# Altium schematic sheet NRF52840.SchDoc: NRF52840
size A3; Author: A.Horvath; Organization: Reichle & De-Massari; Address1: Binzstrasse 32; Address2: 8620 Wetzikon; Address3: Switzerland; DocumentNumber: 3; Revision: V0.1; SheetNumber: 3; SheetTotal: 11
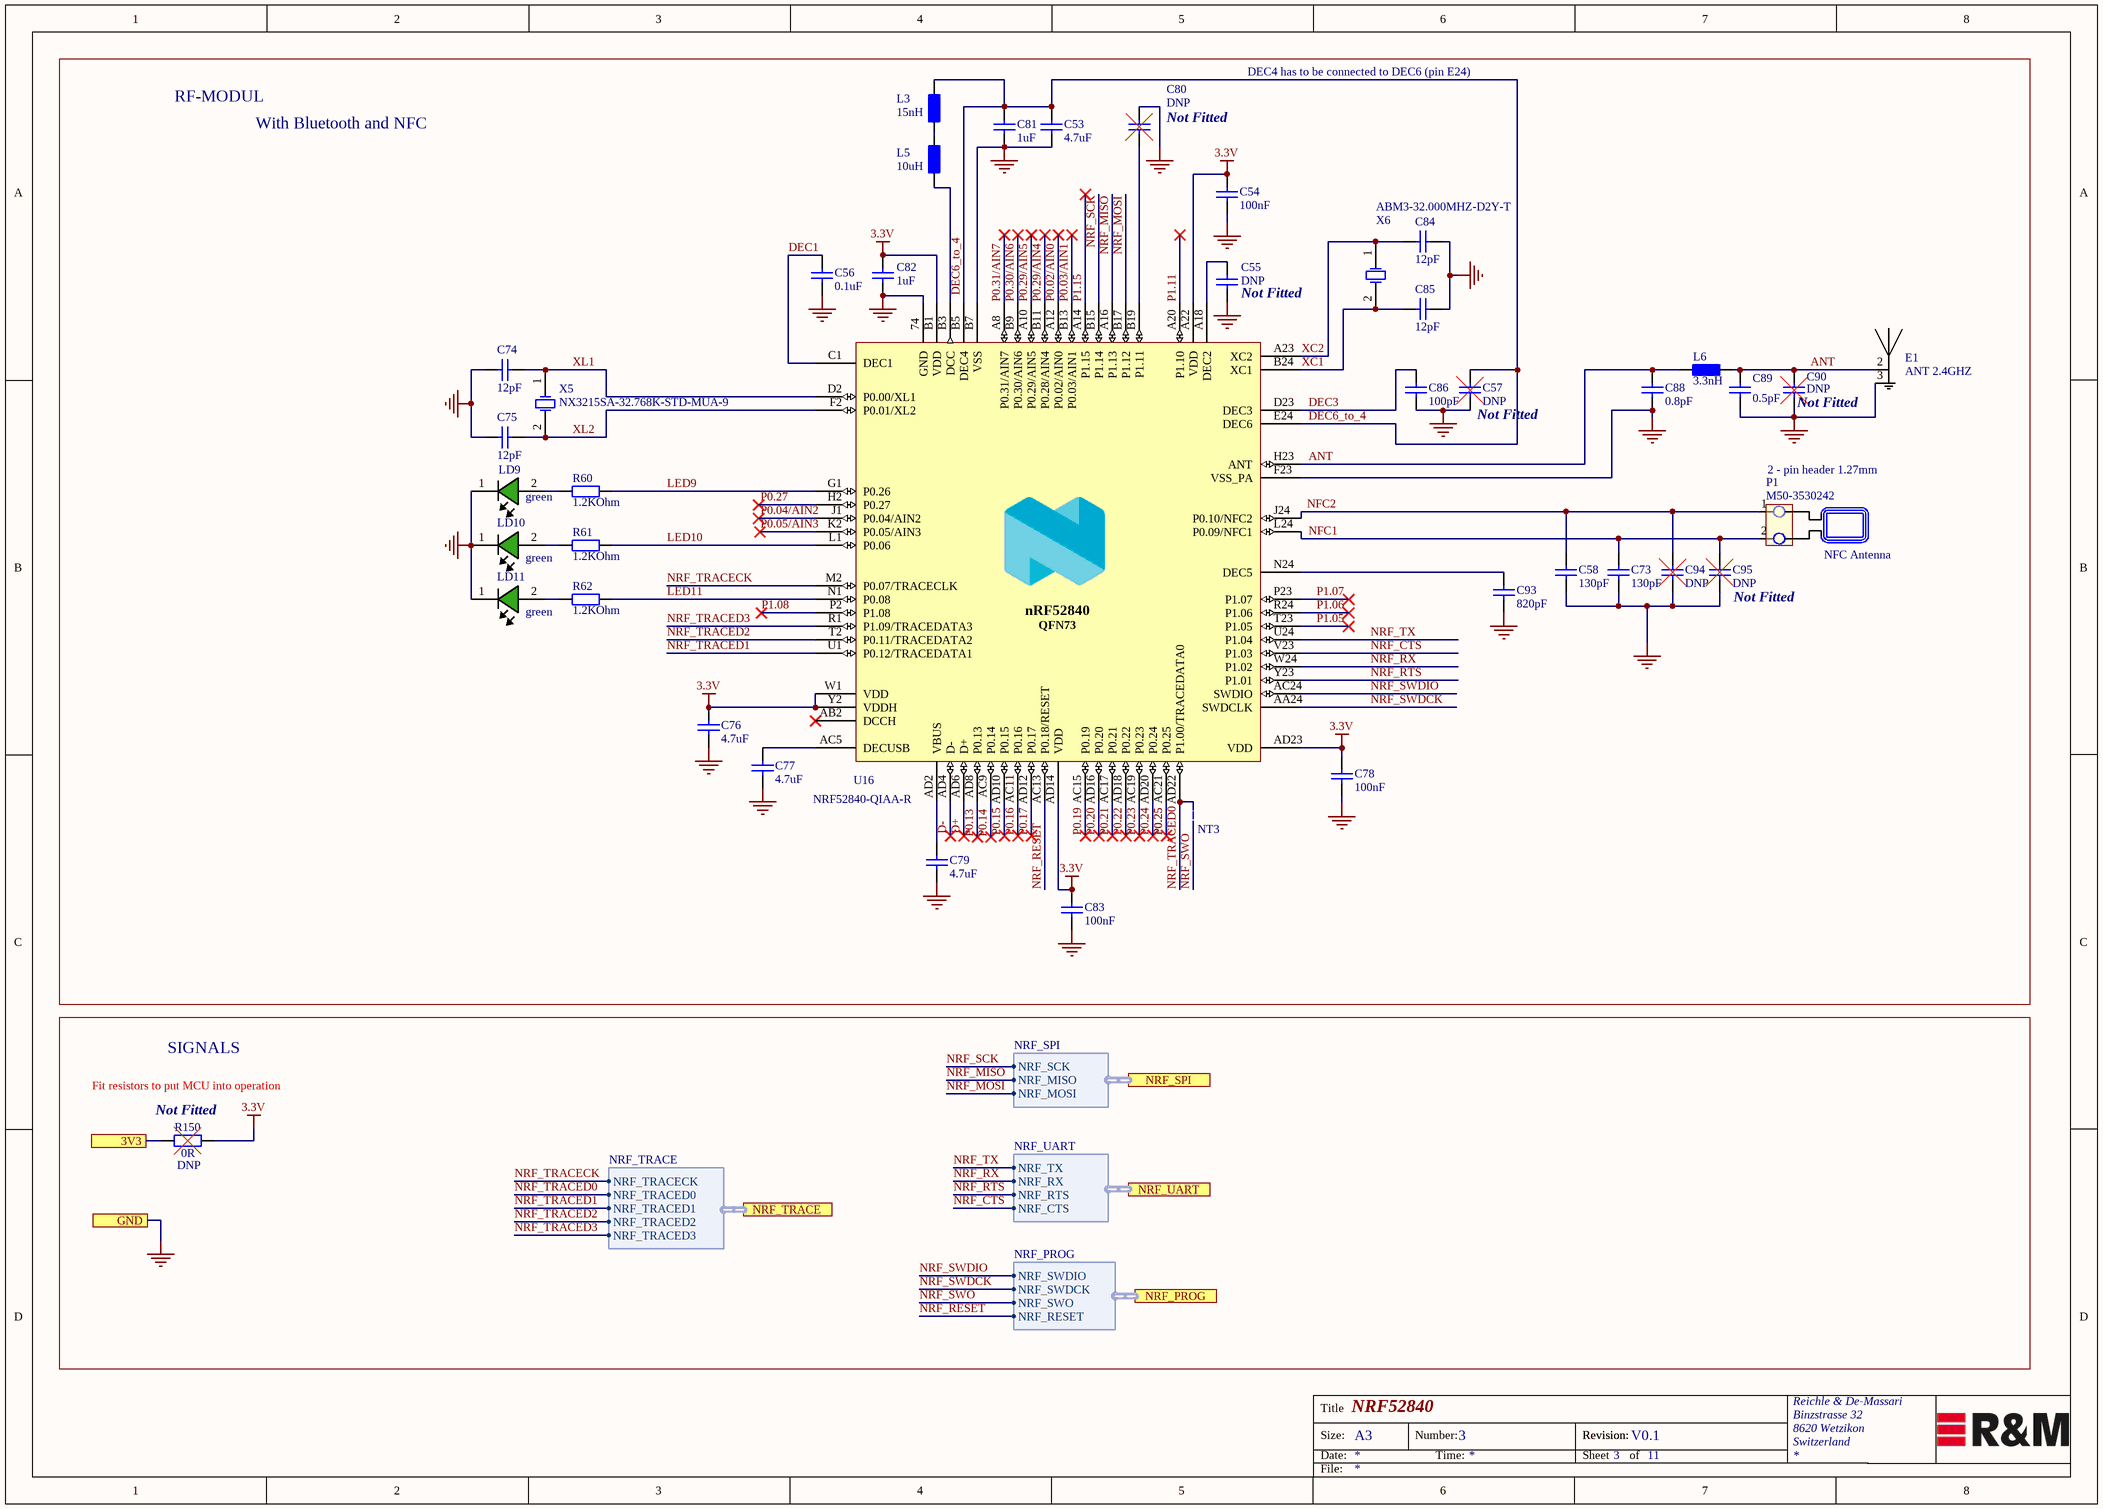
[diagram p0: NRF52840.SchDoc]

## Parts
C53  4.7uF  [Ceramic Capacitor 0402 EIA]
C54  100nF  [Ceramic Capacitor 0402 EIA]
C55  DNP  [Ceramic Capacitor 0402 EIA]
C56  0.1uF  [Ceramic Capacitor 0402 EIA]
C57  DNP  [Ceramic Capacitor 0402 EIA]
C58  130pF  [Ceramic Capacitor 0805 EIA]
C73  130pF  [Ceramic Capacitor 0805 EIA]
C74  12pF  [Ceramic Capacitor 0402 EIA]
C75  12pF  [Ceramic Capacitor 0402 EIA]
C76  4.7uF  [Ceramic Capacitor 0402 EIA]
C77  4.7uF  [Ceramic Capacitor 0402 EIA]
C78  100nF  [Ceramic Capacitor 0402 EIA]
C79  4.7uF  [Ceramic Capacitor 0402 EIA]
C80  DNP  [Ceramic Capacitor 0402 EIA]
C81  1uF  [Ceramic Capacitor 0402 EIA]
C82  1uF  [Ceramic Capacitor 0402 EIA]
C83  100nF  [Ceramic Capacitor 0402 EIA]
C84  12pF  [Ceramic Capacitor 0402 EIA]
C85  12pF  [Ceramic Capacitor 0402 EIA]
C86  100pF  [Ceramic Capacitor 0402 EIA]
C88  0.8pF  [Ceramic Capacitor 0402 EIA]
C89  0.5pF  [Ceramic Capacitor 0402 EIA]
C90  DNP  [Ceramic Capacitor 0805 EIA]
C93  820pF  [Ceramic Capacitor 0402 EIA]
C94  DNP  [Ceramic Capacitor 0805 EIA]
C95  DNP  [Ceramic Capacitor 0805 EIA]
E1  ANT 2.4GHZ  [XCVR_A5839]
L3  15nH  [INDC1005X55N]
L5  10uH  [INDC1608X100N]
L6  3.3nH  [LQG15HS3N3S02D]
LD9  green  [LED_APHHS1005CGCK]
LD10  green  [LED_APHHS1005CGCK]
LD11  green  [LED_APHHS1005CGCK]
NT3  Net-Tie_Small  [NET_TIE]  (value not drawn)  (net tie, no BOM)
P1  M50-3530242  [CONN_2x01_Harwin]  (net tie)
R60  1.2KOhm  [Resistor 0402 EIA]
R61  1.2KOhm  [Resistor 0402 EIA]
R62  1.2KOhm  [Resistor 0402 EIA]
R150  DNP  [Resistor 0805 EIA]
U16  NRF52840-QIAA-R  [AQFN50P700X700X85_HS-74N]
X5  NX3215SA-32.768K-STD-MUA-9  [NX3215SA]
X6  ABM3-32.000MHZ-D2Y-T  [XTAL500X320X130N]

## Blocks framed on the sheet
SIGNALS: R150

## Ports
3V3, GND, NRF_PROG (harness NRF_PROG), NRF_SPI (harness NRF_SPI), NRF_TRACE (harness NRF_TRACE), NRF_UART (harness NRF_UART)

## Harnesses
NRF_TRACE: NRF_TRACECK, NRF_TRACED0, NRF_TRACED1, NRF_TRACED2, NRF_TRACED3
NRF_UART: NRF_TX, NRF_RX, NRF_RTS, NRF_CTS
NRF_SPI: NRF_SCK, NRF_MISO, NRF_MOSI
NRF_PROG: NRF_SWDIO, NRF_SWDCK, NRF_SWO, NRF_RESET

## Nets
3.3V: C54.2 C76.2 C78.2 C82.2 C83.2 R150.2 U16.A22(VDD) U16.AD14(VDD) U16.AD23(VDD) U16.B1(VDD) U16.W1(VDD) U16.Y2(VDDH)
GND: C53.1 C54.1 C55.1 C56.1 C57.1 C58.1 C73.1 C74.2 C75.2 C76.1 C77.1 C78.1 C79.1 C80.2 C81.1 C82.1 C83.1 C84.1 C85.1 C86.1 C88.2 C89.1 C90.1 C93.1 C94.1 C95.1 E1.3(GND) LD9.1 LD10.1 LD11.1 U16.74(GND) U16.B7(VSS) U16.F23(VSS_PA) ; port GND
3V3: R150.1 ; port 3V3
ANT: C88.1 C89.2 C90.2 E1.2(FED) L6.1 L6.2 U16.H23(ANT)
D+: U16.AD6(D+)
D-: U16.AD4(D-)
DEC1: C56.2 U16.C1(DEC1)
DEC3: C86.2 U16.D23(DEC3)
DEC6_to_4: C53.2 C57.2 C81.2 L3.1 U16.B5(DEC4) U16.E24(DEC6)
LED9: R60.2 U16.G1(P0.26)
LED10: R61.2 U16.L1(P0.06)
LED11: R62.2 U16.N1(P0.08)
NFC1: C73.2 C95.2 P1.2 U16.L24(P0.09/NFC1)
NFC2: C58.2 C94.2 P1.1 U16.J24(P0.10/NFC2)
NRF_CTS: U16.V23(P1.03) ; port NRF_UART.NRF_CTS
NRF_MISO: U16.A16(P1.13) ; port NRF_SPI.NRF_MISO
NRF_MOSI: U16.B17(P1.12) ; port NRF_SPI.NRF_MOSI
NRF_RESET: U16.AC13(P0.18/RESET) ; port NRF_PROG.NRF_RESET
NRF_RTS: U16.Y23(P1.01) ; port NRF_UART.NRF_RTS
NRF_RX: U16.W24(P1.02) ; port NRF_UART.NRF_RX
NRF_SCK: U16.B15(P1.14) ; port NRF_SPI.NRF_SCK
NRF_SWDCK: U16.AA24(SWDCLK) ; port NRF_PROG.NRF_SWDCK
NRF_SWDIO: U16.AC24(SWDIO) ; port NRF_PROG.NRF_SWDIO
NRF_SWO: NT3.1 ; port NRF_PROG.NRF_SWO
NRF_TRACECK: U16.M2(P0.07/TRACECLK) ; port NRF_TRACE.NRF_TRACECK
NRF_TRACED0: NT3.2 U16.AD22(P1.00/TRACEDATA0) ; port NRF_TRACE.NRF_TRACED0
NRF_TRACED1: U16.U1(P0.12/TRACEDATA1) ; port NRF_TRACE.NRF_TRACED1
NRF_TRACED2: U16.T2(P0.11/TRACEDATA2) ; port NRF_TRACE.NRF_TRACED2
NRF_TRACED3: U16.R1(P1.09/TRACEDATA3) ; port NRF_TRACE.NRF_TRACED3
NRF_TX: U16.U24(P1.04) ; port NRF_UART.NRF_TX
P0.02/AIN0: U16.A12(P0.02/AIN0)
P0.03/AIN1: U16.B13(P0.03/AIN1)
P0.04/AIN2: U16.J1(P0.04/AIN2)
P0.05/AIN3: U16.K2(P0.05/AIN3)
P0.13: U16.AD8(P0.13)
P0.14: U16.AC9(P0.14)
P0.15: U16.AD10(P0.15)
P0.16: U16.AC11(P0.16)
P0.17: U16.AD12(P0.17)
P0.19: U16.AC15(P0.19)
P0.20: U16.AD16(P0.20)
P0.21: U16.AC17(P0.21)
P0.22: U16.AD18(P0.22)
P0.23: U16.AC19(P0.23)
P0.24: U16.AD20(P0.24)
P0.25: U16.AC21(P0.25)
P0.27: U16.H2(P0.27)
P0.29/AIN4: U16.B11(P0.28/AIN4)
P0.29/AIN5: U16.A10(P0.29/AIN5)
P0.30/AIN6: U16.B9(P0.30/AIN6)
P0.31/AIN7: U16.A8(P0.31/AIN7)
P1.05: U16.T23(P1.05)
P1.06: U16.R24(P1.06)
P1.07: U16.P23(P1.07)
P1.08: U16.P2(P1.08)
P1.11: U16.A20(P1.10)
P1.15: U16.A14(P1.15)
XC1: C85.2 U16.B24(XC1) X6.2(OSC2)
XC2: C84.2 U16.A23(XC2) X6.1(OSC1)
XL1: C74.1 U16.D2(P0.00/XL1) X5.1(OSC1)
XL2: C75.1 U16.F2(P0.01/XL2) X5.2(OSC2)
NetC55_2: C55.2 U16.A18(DEC2)
NetC77_2: C77.2 U16.AC5(DECUSB)
NetC79_2: C79.2 U16.AD2(VBUS)
NetC80_1: C80.1 U16.B19(P1.11)
NetC93_2: C93.2 U16.N24(DEC5)
NetL3_2: L3.2 L5.1
NetL5_2: L5.2 U16.B3(DCC)
NetLD9_2: LD9.2 R60.1
NetLD10_2: LD10.2 R61.1
NetLD11_2: LD11.2 R62.1

Not connected (* = marked no-connect by the designer): U16 AB2(DCCH)*

## Notes on the sheet
- RF-MODUL
- DEC4 has to be connected to DEC6 (pin E24)
- With Bluetooth and NFC
- (near C80) Not Fitted
- (near C55) Not Fitted
- (near C57) Not Fitted
- (near C90) Not Fitted
- (near P1) 2 - pin header 1.27mm
- (near P1) NFC Antenna
- (near C95) Not Fitted
- (near R150) Fit resistors to put MCU into operation
- (near R150) Not Fitted
- (near R150) 0R
- Title
- Size:
- Date:
- A3
- Number:
- Time:
- Revision:
- Sheet
- of
- File:
- (in symbol nRF52840_QIAA) nRF52840; QFN73

## Library data of the parts
C53 C76 C77 C79 = Cap_4.7uF_0603 _6.3V_X7R: 4.7µF ±10% 6.3V Ceramic Capacitor X7R 0603 (1608 Metric); Manufracturer: Taiyo Yuden; Manufacturer PartNr: JMK107BB7475KA-T; voltage: 6.3VDC; Replaceable: yes; tolerance: ±10%; ComponentLink1Description: mouser; ComponentLink1URL: https://www.mouser.ch/ProductDetail/Murata-Electronics/GRM155R60J475ME47D?qs=sGAEpiMZZMs0AnBnWHyRQIE6q%2f4qwWvwbJmEUwav8%2f4%3d; Dielectric Grade: X7R; Footprint/Package: 0603 (1608 metric); Supplier 1: Digi-Key; Supplier Part Number 1: 587-5870-1-ND; value: 4.7uF
C54 C78 C83 = Cap_100nF_0402_6V3: 0.1µF ±10% 6.3V Ceramic Capacitor X7R 0402 (1005 Metric); Manufacturer: Yageo; Manufacturer PartNr: CC0402KRX7R5BB104; Replaceable: yes; volatage: 6.3VDC; Dielectric Grade: X7R; Footprint/Package: 0402 (1005 metric); Supplier 1: Digi-Key; Supplier Part Number 1: 311-1701-1-ND; value: 100nF; tolerance: ±10%
C55 C57 = Cap_DNP_0402: Do not place 0402  (1005 metric) - placeholder; Replaceable: no; value: DNP; tolerance: *; voltage: *; Dielectric Grade: *; Manufacturer: N/A; Manufacturer PartNr: N/A; Footprint/Package: 0402 (1005 metric); Supplier 1: N/A; Supplier Part Number 1: N/A; Remark: do not place
C56 = Cap_0.1uF_0402_16V_10%: 0.1µF ±10% 16V Ceramic Capacitor X7R 0402 (1005 Metric); Manufacturer: Yageo; Manufacturer PartNr: CC0402KRX7R7BB104; voltage: 16VDC; Replaceable: yes; value: 0.1uF; tolerance: 10%; Footprint/Package: 0402 (1005 Metric); Dielectric Grade: X7R; ComponentLink1Description: mouser; ComponentLink1URL: https://www.mouser.ch/ProductDetail/KEMET/C0402C104M4RACAUTO?qs=sGAEpiMZZMs0AnBnWHyRQB295tntAovf0Dzw3tVX6zRfKTwHFThmZw%3d%3d; Supplier 1: Digi-Key; Supplier Part Number 1: 311-1338-1-ND
C58 C73 = Cap_130pF_0805 _50V: 130pF ±5% 50V Ceramic Capacitor C0G, NP0 0805 (2012 Metric); Manufacturer: KEMET; Manufacturer PartNr: C0805C131J5GAC7800; voltage: 50V DC; Dielectric Grade: C0G/NP0; Replaceable: yes; Supplier 1: Digi-Key; Supplier Part Number 1: 399-15446-1-ND; Footprint/Package: 0805 (2012 metric); value: 130pF; tolerance: ±5%; power: -
C74 C75 C84 C85 = Cap_12pF_0402_50V: 12pF ±2% 50V Ceramic Capacitor C0G, NP0 0402 (1005 Metric); Manufacturer: Murata; Manufacturer PartNr: GRM1555C1H120GA01D; voltage: 50VDC; Replaceable: yes; Dielectric Grade: C0G/NP0; value: 12pF; tolerance: ±2%; Footprint/Package: 0402 (1005 metric); Supplier 1: Digi-Key; Supplier Part Number 1: 490-6197-1-ND
C80 = Cap_1uF_0402_10V: 1µF ±10% 10V Ceramic Capacitor X7S 0402 (1005 Metric); Manufacturer: Murata; Manufacturer PartNr: GCM155C71A105KE38D; value: 1uF; voltage: 10VDC; Replaceable: yes; tolerance: 10%; Footprint/Package: 0402 (1005 metric); Dielectric Grade: X7S; ComponentLink1Description: mouser; ComponentLink1URL: https://www.mouser.ch/ProductDetail/Murata-Electronics/GCM155C71A105KE38D?qs=sGAEpiMZZMsh%252b1woXyUXj0FEAttKcN54ouz5zO04smg%3d; Supplier Part Number 1: 490-13409-1-ND; Supplier 1: Digi-Key
C81 C82 = Cap_1uF_0402_10V: 1µF ±10% 10V Ceramic Capacitor X7S 0402 (1005 Metric); Manufacturer: Murata; Manufacturer PartNr: GCM155C71A105KE38D; voltage: 10VDC; Replaceable: yes; value: 1uF; tolerance: 10%; Footprint/Package: 0402 (1005 metric); Dielectric Grade: X7S; ComponentLink1Description: mouser; ComponentLink1URL: https://www.mouser.ch/ProductDetail/Murata-Electronics/GCM155C71A105KE38D?qs=sGAEpiMZZMsh%252b1woXyUXj0FEAttKcN54ouz5zO04smg%3d; Supplier Part Number 1: 490-13409-1-ND; Supplier 1: Digi-Key
C86 = Cap_100pF_0402_10V: 100pF ±5% 10V Keramikkondensatoren C0G, NP0 0402 (1005 metrisch); Manufacturer: Yageo; Manufacturer PartNr: 885012005013; voltage: 10VDC; Replaceable: yes; Dielectric Grade: C0G/NP0; value: 100pF; tolerance: ±5%; Footprint/Package: 0402 (1005 metric); Supplier 1: Digi-Key; Supplier Part Number 1: 732-7431-1-ND
C88 = Cap_0.8pF_0402_50V: 0.8pF ±0.1pF 50V Ceramic Capacitor C0G, NP0 0402 (1005 Metric); Manufacturer: Murata; Manufacturer PartNr: GJM1555C1HR80BB01D; Dielectric Grade: C0G/NP0; Voltage: 50 VDC; Replaceable: yes; Supplier 1: Digi-Key; Supplier Part Number 1: 490-6080-1-ND; Footprint/Package: 0402 (1005 metric); value: 0.8pF; ComponentLink1URL: http://search.murata.co.jp/Ceramy/image/img/A01X/G101/ENG/GJM1555C1HR80BB01-01.pdf; ComponentLink1Description: http://search.murata.co.jp/Ceramy/image/img/A01X/G101/ENG/GJM1555C1HR80BB01-01.pdf; ComponentLink2URL: http://search.murata.co.jp/Ceramy/image/img/w_hinm/L0005E.pdf; ComponentLink2Description: http://search.murata.co.jp/Ceramy/image/img/w_hinm/L0005E.pdf; ComponentLink3URL: http://psearch.murata.com/capacitor/product/GJM1555C1HR80BB01%23.pdf; ComponentLink3Description: http://psearch.murata.com/capacitor/product/GJM1555C1HR80BB01%23.pdf; ComponentLink4URL: https://www.verical.com/server-webapp/html/getDatasheet?partID=75095; ComponentLink4Description: https://www.verical.com/server-webapp/html/getDatasheet?partID=75095; tolerance: ±0.1pF; power: -
C89 = Cap_0.5pF_0402_50V: 0.5pF ±0.05pF 50V Ceramic Capacitor C0G, NP0 0402 (1005 Metric), Murata; Manufacturer PartNr: GJM1555C1HR50WB01D; Dielectric Grade: C0G/NP0; Voltage: 50 VDC; Replaceable: yes; Supplier 1: Digi-Key; Supplier Part Number 1: 490-11250-1-ND; Manufacturer: Murata; Footprint/Package: 0402 (1005 metric); value: 0.5pF; tolerance: ±0.05pF; power: -; ComponentLink1Description: Datasheet; ComponentLink1URL: https://search.murata.co.jp/Ceramy/image/img/A01X/G101/ENG/GJM1555C1HR50WB01-01.pdf
C90 C94 C95 = Cap_DNP_0805: Do not place 0805 (2012 metric) - placeholder; Replaceable: no; value: DNP; tolerance: *; voltage: *; Dielectric Grade: *; Manufacturer: N/A; Manufacturer PartNr: N/A; Footprint/Package: 0805 (2012 metric); Supplier 1: N/A; Supplier Part Number 1: N/A; Remark: do not place
C93 = Cap_820pF_0402_50V: 820pF ±5% 50V Ceramic Capacitor C0G, NP0 0402 (1005 Metric); Manufacturer: Muarata Electronics; Manufacturer PartNr: GRM1555C1H821JA01J; voltage: 50 VDC; Replaceable: no; Dielectric Grade: C0G/NP0; value: 820pF; tolerance: ±5%; Footprint/Package: 0402 (1005 metric); ComponentLink1Description: digikey; ComponentLink1URL: https://www.digikey.com/product-detail/en/murata-electronics-north-america/GJM1555C1H150FB01D/490-11191-6-ND/5333833; Supplier 1: Digi-Key; Supplier Part Number 1: 490-11407-1-ND
E1 = Antenna_2.4GHZ_PCB: 2,4GHz Bluetooth, Wi-Fi, Zigbee PCB HF-Antenna,1dBi SMD, Antenova; Manufacturer Part Number: A5839; Replaceable: no; Package: None; Manufacturer: Antenova; value: ANT 2.4GHZ; Supplier 1: Digi-Key; Supplier Part Number 1: 627-1011-1-ND; Footprint/Package: specific see datasheet; tolerance: -; power: -; Dielectric Grade: -; voltage: -
L3 = Ind_15nH_0402: 15nH Unshielded Multilayer Inductor 320mA 460mOhm Max 0402 (1005 Metric),  Taiyo Yuden; Manufacturer PartNr: HK100515NJ-T; Replaceable: no; value: 15uH; tolerance: ±5%; Manufacturer: TAIYO YUDEN; voltage: *; power: -; Supplier Part Number 1: 587-1521-1-ND; Supplier 1: Digi-Key; Dielectric Grade: -; Footprint/Package: 0402 (1005 metric)
L5 = Ind_10uH_0603: 10µH Unshielded Wirewound Inductor 80mA 360mOhm 0603 (1608 Metric); Manufacturer: TAIYO YUDEN; Manufacturer PartNr: LBMF1608T100K; tolerance: ±10%; Replaceable: no; value: 10uH; Supplier 1: Digi-Key; Supplier Part Number 1: 587-1714-6-ND; voltage: *; power: *; Footprint/Package: 0603 (1608 metric)
L6 = Ind_3.3nH_0402: 3.3nH Unshielded Multilayer Inductor 800mA 170mOhm Max 0402 (1005 Metric); Manufacturer: Murata Electronics; Replaceable: no; Manufacturer PartNr: LQG15HS3N3S02D; Dielectric Grade: -; voltage: -; Supplier 1: DIgi-Key; Supplier Part Number 1: 490-2616-1-ND; Footprint/Package: 0402 (1005 metric); tolerance: -; value: 3.3nH
LD9-LD11 = LED_GREEN_0402: Green 570nm LED Indication - Discrete 2.1V 0402 (1005 Metric); Manufacturer: Kingbright; Manufacturer PartNr: APHHS1005CGCK; Replaceable: yes; voltage: 2.1V (forward); Footprint/Package: 0420 (1005 metric); value: green; Supplier 1: Digi-Key; Supplier Part Number 1: 754-1101-1-ND; Dielectric Grade: -; tolerance: -; power: -
NT3 = Net-Tie_Small: Net-Tie allowing to short two different types of nets.
P1 = CONN_1x2_M50-3530242: 2 Pin, 1 Row, Jumper, 1.27mm; Manufacturer: Harwin; Replaceable: yes; Footprint/Package: 1.27mm; ComponentLink1Description: digikey; ComponentLink1URL: https://www.digikey.com/product-detail/en/harwin-inc/M50-3530242/952-3598-ND/7044013; Supplier1: digikey; Supplier Part Number 1: 952-3598-ND; Dielectric Grade: -; power: -; voltage: -; value: M50-3530242; tolerance: -; Manufacturer PartNr: M50-3530242
R60-R62 = Res_1K2_0402: 1.2 kOhms ±0.5% 0.063W, 1/16W Chip Resistor 0402 (1005 Metric) Thin Film; Manufacturer: Panasonic; Manufacturer PartNr: ERA-2AED122X; value: 1.2K; voltage: 50V; Replaceable: yes; Supplier 1: Digi-Key; Supplier Part Number 1: P1.2KDECT-ND; Footprint/Package: 0402 (1005 metric); tolerance: ±0.5%; power: 0.063W, 1/16W; Dielectric Grade: -
R150 = Res_DNP_0805: Resistor: do not populate; Replaceable: no; value: DNP; tolerance: *; power: *; Manufacturer: do not populate; Footprint/Package: 0805; Manufacturer PartNr: do not populate
U16 = nRF52840_QIAA: Multi-protocol Bluetooth Low Energy, IEEE 802.15.4, ANT and 2.4GHz proprietary system-on-chip; Manufacturer: Nordic Semiconductor; Replaceable: no; voltage: 1.7V ~ 5.5V; Manufacturer PartNr: NRF52840-QIAA-R; power: -; Dielectric Grade: -; value: NRF52840-QIAA-R; Supplier 1: Digi-Key; Footprint/Package: 73-AQFN (7x7mm); Supplier  Part Number 1: 1490-1071-1-ND; tolerance: -
X5 = CRYSTAL_2Pin_ NX3215SA-32.768K-STD-MUA-9: 32.768kHz ±20ppm Crystal 9pF 70 kOhms 2-SMD, No Lead; Manufacturer: NDK America; Replaceable: no; Footprint/Package: 2-SMD, specific see datasheet; voltage: -; Manufacturer PartNr: NX3215SA-32.768K-STD-MUA-9; value: NX3215SA-32.768K-STD-MUA-9; Supplier 1: Digi-Key; Supplier Part Number 1: 644-1155-1-ND; tolerance: ±20ppm; Dielectric Grade: -; power: -
X6 = CRYSTAL_2Pin_32.000MHZ-D2Y-T: Crystal  32MHz ±20ppm Crystal 18pF 25 Ohms 2-SMD, No Lead; Manufacturer: Abracon; Replaceable: no; Footprint/Package: 2-SMD, specific see datasheet; voltage: -; Manufacturer PartNr: ABM3-32.000MHZ-D2Y-T; Price: None; value: ABM3-32.000MHZ-D2Y-T; Supplier 1: Digi-Key; Supplier Part Number 1: 535-10648-6-ND; tolerance: ±20ppm; Dielectric Grade: -